# Altium schematic sheet AdaptiveLightingSatellite.SchDoc
size A
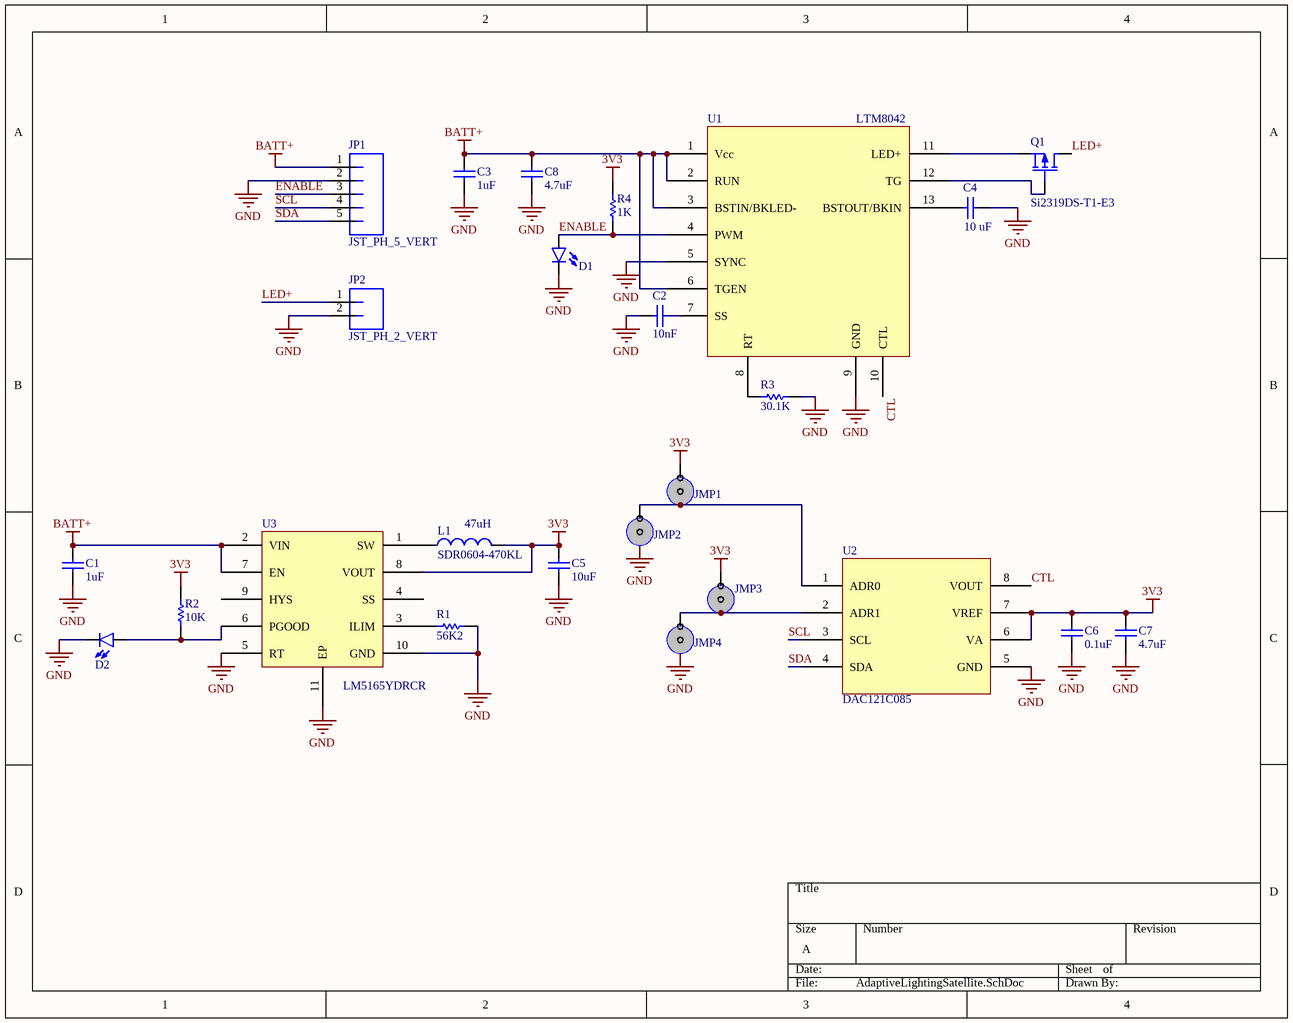
[diagram p0: AdaptiveLightingSatellite.SchDoc]

## Parts
C1  1uF  [C0805[2012X120]]
C2  value 10nF  [C0402[1005X55]]  (hidden comment: 10nF 100V 0402)
C3  1uF  [C0805[2012X120]]
C4  value 10 uF  [C1210[3225X150]]  (hidden comment: 10uF 50V X5R +/-20% 1210)
C5  value 10uF  [C0402[1005X55]]  (hidden comment: 10uF 6.3V 0402)
C6  value 0.1uF  [C0402[1005X55]]  (hidden comment: 0.1uF 6.3V 0402)
C7  value 4.7uF  [C0402[1005X55]]  (hidden comment: 4.7uF 6.3V 0402)
C8  value 4.7uF  [C1210[3225X200]]  (hidden comment: 4.7uF 100V 1210)
D1  LED_0603_GREEN_5mA  [LED0603]  (value not drawn)
D2  LED_0603_BLUE_5mA  [LED0603]  (value not drawn)
JMP1  Solder Jumper  [SOLDER-JUMPER]  (value not drawn)
JMP2  Solder Jumper  [SOLDER-JUMPER]  (value not drawn)
JMP3  (no value)  [SOLDER-JUMPER]
JMP4  Solder Jumper  [SOLDER-JUMPER]  (value not drawn)
JP1  JST_PH_5_VERT  [JST-PH-5-PTH-VERT]
JP2  JST_PH_2_VERT  [JST-PH-2-PTH-VERT]
L1  SDR0604-470KL  value 47uH  [SDR0604]
Q1  Si2319DS-T1-E3  [SOT23-3]
R1  value 56K2  [R0402[1005]]  (hidden comment: 56K2 1% 0402)
R2  value 10K  [R0402[1005]]  (hidden comment: 10K 1% 0402)
R3  value 30.1K  [R0603[1608]]  (hidden comment: 30.1K 1% 0603)
R4  value 1K  [R0402[1005]]  (hidden comment: 1K 1% 0402)
U1  LTM8042  [LGA-77]
U2  DAC121C085  [TSSOP-8]
U3  LM5165YDRCR  [VSON-10 (3mmx3mm)]

## Nets
3V3: C5.2 C6.1 C7.2 JMP1.1 JMP3.1 L1.2 R2.1 R4.2 U2.6(VA) U2.7(VREF) U3.8(VOUT)
BATT+: C1.2 C3.2 C8.2 JP1.1 U1.1(Vcc) U1.2(RUN) U1.3(BSTIN/BKLED-) U1.6(TGEN) U3.2(VIN) U3.7(EN)
GND: C1.1 C2.1 C3.1 C4.2 C5.1 C6.2 C7.1 C8.1 D1.C D2.C JMP2.2 JMP4.2 JP1.2 JP2.2 R1.2 R3.1 U1.5(SYNC) U1.9(GND) U2.5(GND) U3.5(RT) U3.10(GND) U3.11(EP)
CTL: U1.10(CTL) U2.8(VOUT)
ENABLE: D1.A JP1.3 R4.1 U1.4(PWM)
LED+: JP2.1 Q1.2(D)
SCL: JP1.4 U2.3(SCL)
SDA: JP1.5 U2.4(SDA)
NetC2_2: C2.2 U1.7(SS)
NetC4_1: C4.1 U1.13(BSTOUT/BKIN)
NetD2_A: D2.A R2.2 U3.6(PGOOD)
NetJMP1_2: JMP1.2 JMP2.1 U2.1(ADR0)
NetJMP3_2: JMP3.2 JMP4.1 U2.2(ADR1)
NetL1_1: L1.1 U3.1(SW)
NetQ1_1: Q1.1(G) U1.12(TG)
NetQ1_3: Q1.3(S) U1.11(LED+)
NetR1_1: R1.1 U3.3(ILIM)
NetR3_2: R3.2 U1.8(RT)

Not connected (* = marked no-connect by the designer): U3 4(SS) 9(HYS)

## Library data of the parts
C1 C3 = CAP_1uF_100V_0805_20%: CAP_1uF 50V 20% 0805 (2012 metric); Manufacturer: TDK; PartNumber: C2012X5R1H105M085AB; Mounting Technology: Surface Mount; Voltage: 50V; Package Description: 0805 (2012 Metric); Package Reference: 0805; Tolerance: 20%; Value: 1uF
C2 = CAP_10nF_100V_0402_10%: 10nF 100V 10% 0402 (1005 Metric); PartNumber: C1005X7S2A103K050BB; Manufacturer: TDK; Mounting Technology: Surface Mount; PackageReference: 0402; PackageDescription: 0402 (1005 Metric); Voltage: 100V; Tolerance: 10%
C4 = CAP_10uF_50V_1210_20%: Manufacturer: Taiyo Yuden; PartNumber: UMK325BJ106MM-T; Tolerance: 20%; Voltage: 50V; Mounting Technology: Surface Mount; PackageReference: 1210; PackageDescription: 1210 (3325 Metric)
C5 = CAP_10uF_6.3V_0402_20%: 10uF 6.3V 20% 0402 (1005 Metric); PartNumber: GRM155R60J106ME44D; Manufacturer: Murata; Mounting Technology: Surface Mount; PackageReference: 0402; PackageDescription: 0402 (1005 Metric); Voltage: 6.3V; Tolerance: 20%
C6 = CAP_0.1uF_6.3V_0402_10%: 0.1uF 6.3V 10% 0402 (1005 Metric); PartNumber: GRM155R70J104KA01D; Manufacturer: Murata; Mounting Technology: Surface Mount; PackageReference: 0402; PackageDescription: 0402 (1005 Metric); Voltage: 6.3V; Tolerance: 10%
C7 = CAP_4.7uF_6.3V_0402_20%: 4.7uF 6.3V 20% 0402 (1005 Metric); PartNumber: GRM155R60J475ME47D; Manufacturer: Murata; Mounting Technology: Surface Mount; PackageReference: 0402; PackageDescription: 0402 (1005 Metric); Voltage: 6.3V; Tolerance: 20%
C8 = CAP_4.7uF_100V_1210_10%: 4.7uF 100V 10% 1210 (3225 Metric); PartNumber: GRJ32DC72A475KE11L; Manufacturer: Murata; Mounting Technology: Surface Mount; PackageReference: 1210; PackageDescription: 1210 (3225 Metric); Voltage: 100V; Tolerance: 10%
D1 = LED_0603_GREEN_5mA: PartNumber: LTST-C193TGKT-5A; Manufacturer: Lite-On Inc.; PackageReference: 0603; PackageDescription: 0603 (1608 Metric); Mounting Technology: Surface Mount
D2 = LED_0603_BLUE_5mA: PartNumber: LTST-C193TBKT-5A; Manufacturer: Lite-On Inc.; PackageReference: 0603; PackageDescription: 0603 (1608 Metric); Mounting Technology: Surface Mount
JMP1-JMP4 = SOLDER_JMPR
JP1 = JST_PH_5_VERT: Manufacturer: JST Sales America, Inc.; PartNumber: B5B-PH-K-S(LF)(SN); PackageReference: JST-PH; Mounting Technology: Through Hole
JP2 = JST_PH_2_VERT: Manufacturer: JST Sales America, Inc.; PartNumber: B2B-PH-K-S(LF)(SN); Mounting Technology: Through Hole; PackageReference: JST-PH
L1 = SDR0604-470KL: 47uH 10% 0.72A 0604; Manufacturer: Bourns; PartNumber: SDR0604-470KL; PackageReference: SDR0604; Mounting Technology: Surface Mount; Current: 0.72A
Q1 = Si2319DS-T1-E3: P-Channel MOSFET; Manufacturer: Vishay; PartNumber: Si2319DS-T1-E3 #PBF; Mounting Technology: Surface Mount; PackageReference: SOT23-3
R1 = RES_56K2_0402_1%: 56K2 0.063W 1% 0402 (1005 Metric); Manufacturer: KOA Speer; PartNumber: RK73H1ETTP5622F; Tolerance: 1%; Power: 0.063W; Mounting Technology: Surface Mount; PackageReference: 0402; PackageDescription: 0402 (1005 Metric); ComponentLink1Description: Datasheet; ComponentLink1URL: http://www.koaspeer.com/catimages/Products/RK73H/RK73H.pdf
R2 = RES_10K_0402_1%: 10K 0.063W 1% 0402 (1005 Metric); Manufacturer: KOA Speer; PartNumber: RK73H1ETTP1002F; Tolerance: 1%; Power: 0.063W; Mounting Technology: Surface Mount; PackageReference: 0402; PackageDescription: 0402 (1005 Metric); ComponentLink1Description: Datasheet; ComponentLink1URL: http://www.koaspeer.com/catimages/Products/RK73H/RK73H.pdf
R3 = RES_30.1K_0603_1%: 30.1K 0.06W 1% 0603 (1005 Metric); Manufacturer: NIC Corporation; PartNumber: NRC06F3012TRF; Power: 0.06; Tolerance: 1%; Mounting Technology: Surface Mount; PackageReference: 0603; PackageDescription: 0603 (1608 Metric); ComponentLink1Description: Datasheet; ComponentLink1URL: https://www.arrow.com/en/products/nrc06f3012trf/nic-components
R4 = RES_1K_0402_1%: 1K 0.063W 1% 0402 (1005 Metric); Manufacturer: KOA Speer; PartNumber: RK73H1ETTP1001F; Tolerance: 1%; Power: 0.063W; Mounting Technology: Surface Mount; PackageReference: 0402; PackageDescription: 0402 (1005 Metric); ComponentLink1Description: Datasheet; ComponentLink1URL: http://www.koaspeer.com/catimages/Products/RK73H/RK73H.pdf
U1 = LTM8042: pin to pad: 1>A6+A7+B6+B7 2>F1 3>C5+C6+C7+D5+D6+D7 4>K1 5>G1 6>L3 7>J1 8>H1 9>A1+A2+A3+A4+A5+B1+B2+B3+B4+B5+C1+C2+C3+C4+D1+D2+D3+D4+E1+E2+E3+E4+E5+E6+E7+F2+F3+F4+F5+F6+F7+G2+G3+G4+H2+H3+H4+J2+J3+J4+K2+K3+K4+L1+L4 10>L2 11>K5+K6+K7+L5+L6+L7 12>J7 13>G5+G6+G7+H5+H6+H7+J5+J6; Manufacturer: Linear Technology; PartNumber: LTM8042EV#PBF; Mounting Technology: Surface Mount; PackageReference: LGA
U2 = DAC121C085: 12 Bit Digital to Analog Converter; Manufacturer: Texas Instruments; Mounting Technology: Surface Mount; PartNumber: DAC121C085; PackageReference: VSSOP-8
U3 = LM5165YDRCR: LM5165 3-V to 65-V Input, 150-mA Synchronous Buck Converter; Manufacturer: Texas Instruments; PartNumber: LM5165YDRCR; Mounting Technology: Surface Mount; PackageReference: VSON-10